# EAGLE schematic jura (EAGLE 7.2.0)
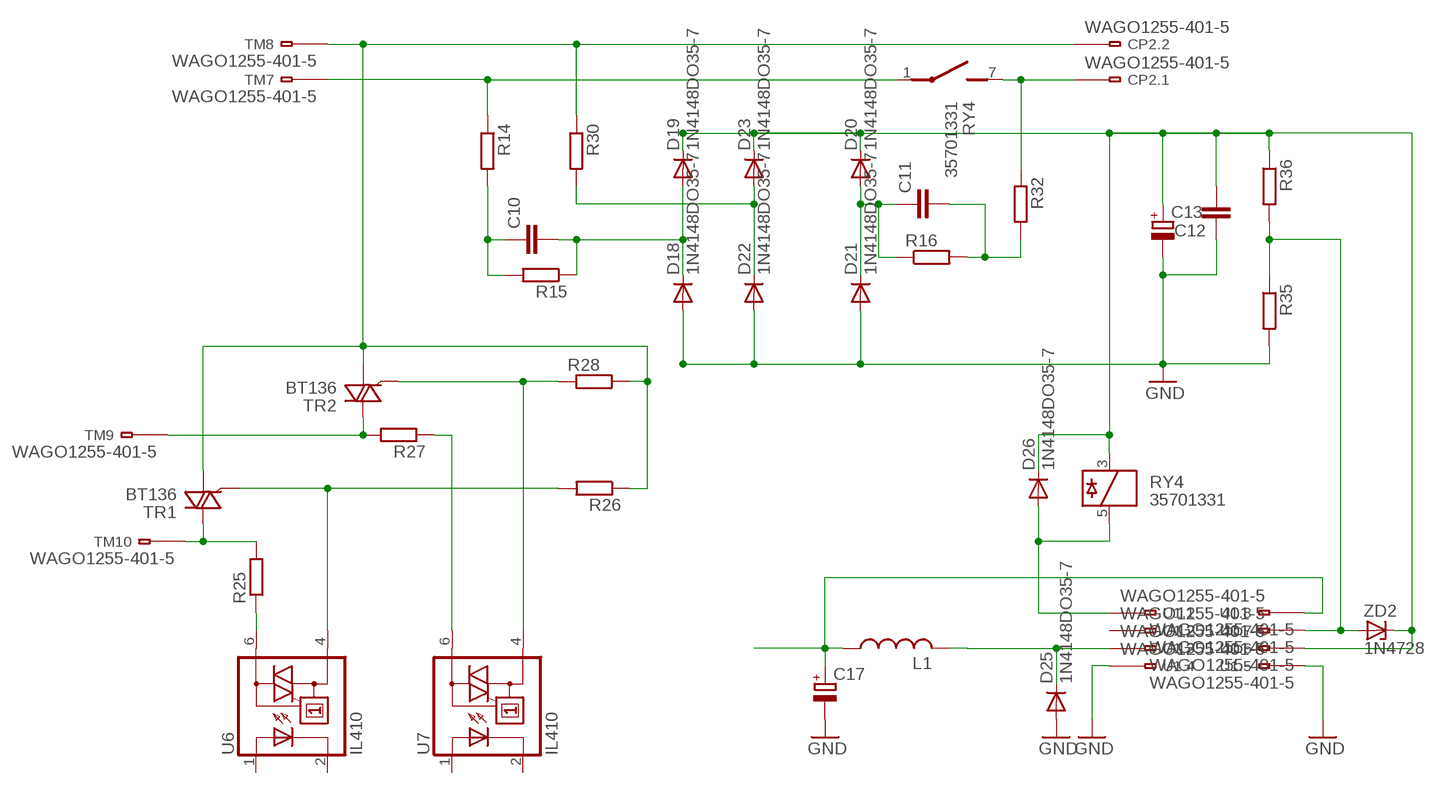
[diagram p0: schematic, sheet 1]

## Parts
C10  C-EU025-025X050  [C025-025X050]
C11  C-EU025-025X050  [C025-025X050]
C12  C-EU025-025X050  [C025-025X050]
C13  CPOL-EUE2-4  [E2-4]
C17  CPOL-EUE2-4  [E2-4]
CP2.1  WAGO1255-401-5  [255-401-5]
CP2.2  WAGO1255-401-5  [255-401-5]
D18  1N4148DO35-7  [DO35-7]
D19  1N4148DO35-7  [DO35-7]
D20  1N4148DO35-7  [DO35-7]
D21  1N4148DO35-7  [DO35-7]
D22  1N4148DO35-7  [DO35-7]
D23  1N4148DO35-7  [DO35-7]
D25  1N4148DO35-7  [DO35-7]
D26  1N4148DO35-7  [DO35-7]
L1  L-US0204/7  [0204/7]
R14  R-EU_0204/7  [0204/7]
R15  R-EU_0204/7  [0204/7]
R16  R-EU_0204/7  [0204/7]
R25  R-EU_0204/7  [0204/7]
R26  R-EU_0204/7  [0204/7]
R27  R-EU_0204/7  [0204/7]
R28  R-EU_0204/7  [0204/7]
R30  R-EU_0204/7  [0204/7]
R32  R-EU_0204/7  [0204/7]
R35  R-EU_0204/7  [0204/7]
R36  R-EU_0204/7  [0204/7]
RY4  35701331  [REED]
TM7  WAGO1255-401-5  [255-401-5]
TM8  WAGO1255-401-5  [255-401-5]
TM9  WAGO1255-401-5  [255-401-5]
TM10  WAGO1255-401-5  [255-401-5]
TR1  BT136  [TO220AB]
TR2  BT136  [TO220AB]
U1.1  WAGO1255-401-5  [255-401-5]
U1.2  WAGO1255-401-5  [255-401-5]
U1.3  WAGO1255-401-5  [255-401-5]
U1.4  WAGO1255-401-5  [255-401-5]
U1.5  WAGO1255-401-5  [255-401-5]
U1.6  WAGO1255-401-5  [255-401-5]
U1.7  WAGO1255-401-5  [255-401-5]
U1.8  WAGO1255-401-5  [255-401-5]
U6  IL410  [DIL06]
U7  IL410  [DIL06]
ZD2  1N4728  [DO41Z10]

## Nets
GND: C12.1 C13.- C17.- D18.A D21.A D22.A D25.A R35.2 U1.4.B1 U1.5.B1
N$1: R14.1 RY4.1(2:P) TM7.B1
N$2: C10.1 R14.2 R15.2
N$3: CP2.2.B1 R26.1 R28.2 R30.1 TM8.B1 TR1.1(A1) TR2.1(A1)
N$4: C11.2 R16.2 R32.2
N$5: C12.2 C13.+ D19.C D20.C D23.C D26.C R36.1 RY4.3 U1.6.B1 ZD2.C
N$6: C10.2 D18.C D19.A R15.1
N$7: CP2.1.B1 R32.1 RY4.7(2:S)
N$9: D25.C L1.2 U1.3.B1
N$10: R27.2 TM9.B1 TR2.2(A2)
N$11: R25.2 TM10.B1 TR1.2(A2)
N$12: C11.1 D20.A D21.C R16.1
N$14: D22.C D23.A R30.2
N$15: R26.2 TR1.3(G) U6.4(A1)
N$16: R28.1 TR2.3(G) U7.4(A1)
N$17: C17.+ L1.1 U1.8.B1
N$18: R35.1 R36.2 U1.7.B1 ZD2.A
N$19: R25.1 U6.6(A2)
N$20: R27.1 U7.6(A2)
N$21: D26.A RY4.5 U1.1.B1
Unconnected: CP2.1.A1 CP2.2.A1 TM7.A1 TM8.A1 TM9.A1 TM10.A1 U1.1.A1 U1.2.A1 U1.2.B1 U1.3.A1 U1.4.A1 U1.5.A1 U1.6.A1 U1.7.A1 U1.8.A1 U6.1(A) U6.2(C) U7.1(A) U7.2(C)

## Library data of the parts
C10-C12 = rcl:C-EU: CAPACITOR, European symbol
C13 C17 = rcl:CPOL-EU: POLARIZED CAPACITOR, European symbol
CP2.1 CP2.2 TM7-TM10 U1.1-U1.8 = con-wago:WAGO1: WAGO Cage Clamp; MPN: 255-401; OC_FARNELL: 4015319; OC_NEWARK: 28K9763
D18-D23 D25 D26 = diode:1N4148: DIODE high speed (Philips)
L1 = rcl:L-US: INDUCTOR, American symbol
R14-R16 R25-R28 R30 R32 R35 R36 = resistor:R-EU_: RESISTOR, European symbol
RY4 = relay:35701331: RELAY reed, 1 x norm. open with polarity; OC_FARNELL: unknown; OC_NEWARK: unknown
TR1 TR2 = triac:BT136: Triac BT136 series E sensitive gate Source: http://www.nxp.com/acrobat_download/datasheets/BT136_SERIES_E_2.pdf
U6 U7 = optocoupler:IL410: SIEMENS OPTO COUPLER; MF: VISHAY/TELEFUNKEN; MPN: IL410; OC_FARNELL: 1045434; OC_NEWARK: 58K1715
ZD2 = diode:1N4728: Z DIODE 3.3 V, 1W, 5 percent